# Altium schematic sheet 54. SOC CORE HCPS-B.SchDoc: HCPS B - VDD CORE
size 513 x 386 mm; Project: PROC154E2(001)_SK_AM69; Issue: 1.0; RevCode: E3; Page Create Date: March  8, 1995; Variant Name: Core Design; Schematic Page Number: 54; Page Number: 54; Page Size: C; Comment: MISTRAL_TITLEBLK_CSIZE_1; Page Count: 62; Schematic Page Count: 62; Name: PROC154E2 001 SK AM69; DsnPath: C:\Users\danie\Downloads\sprr466c\PROC154E3_RP\PROC154E3_SCH.DSN; SchematicName: SCHEMATIC1; PageName: 54. SOC CORE HCPS-B; PageSize: C; TopSchematic: True
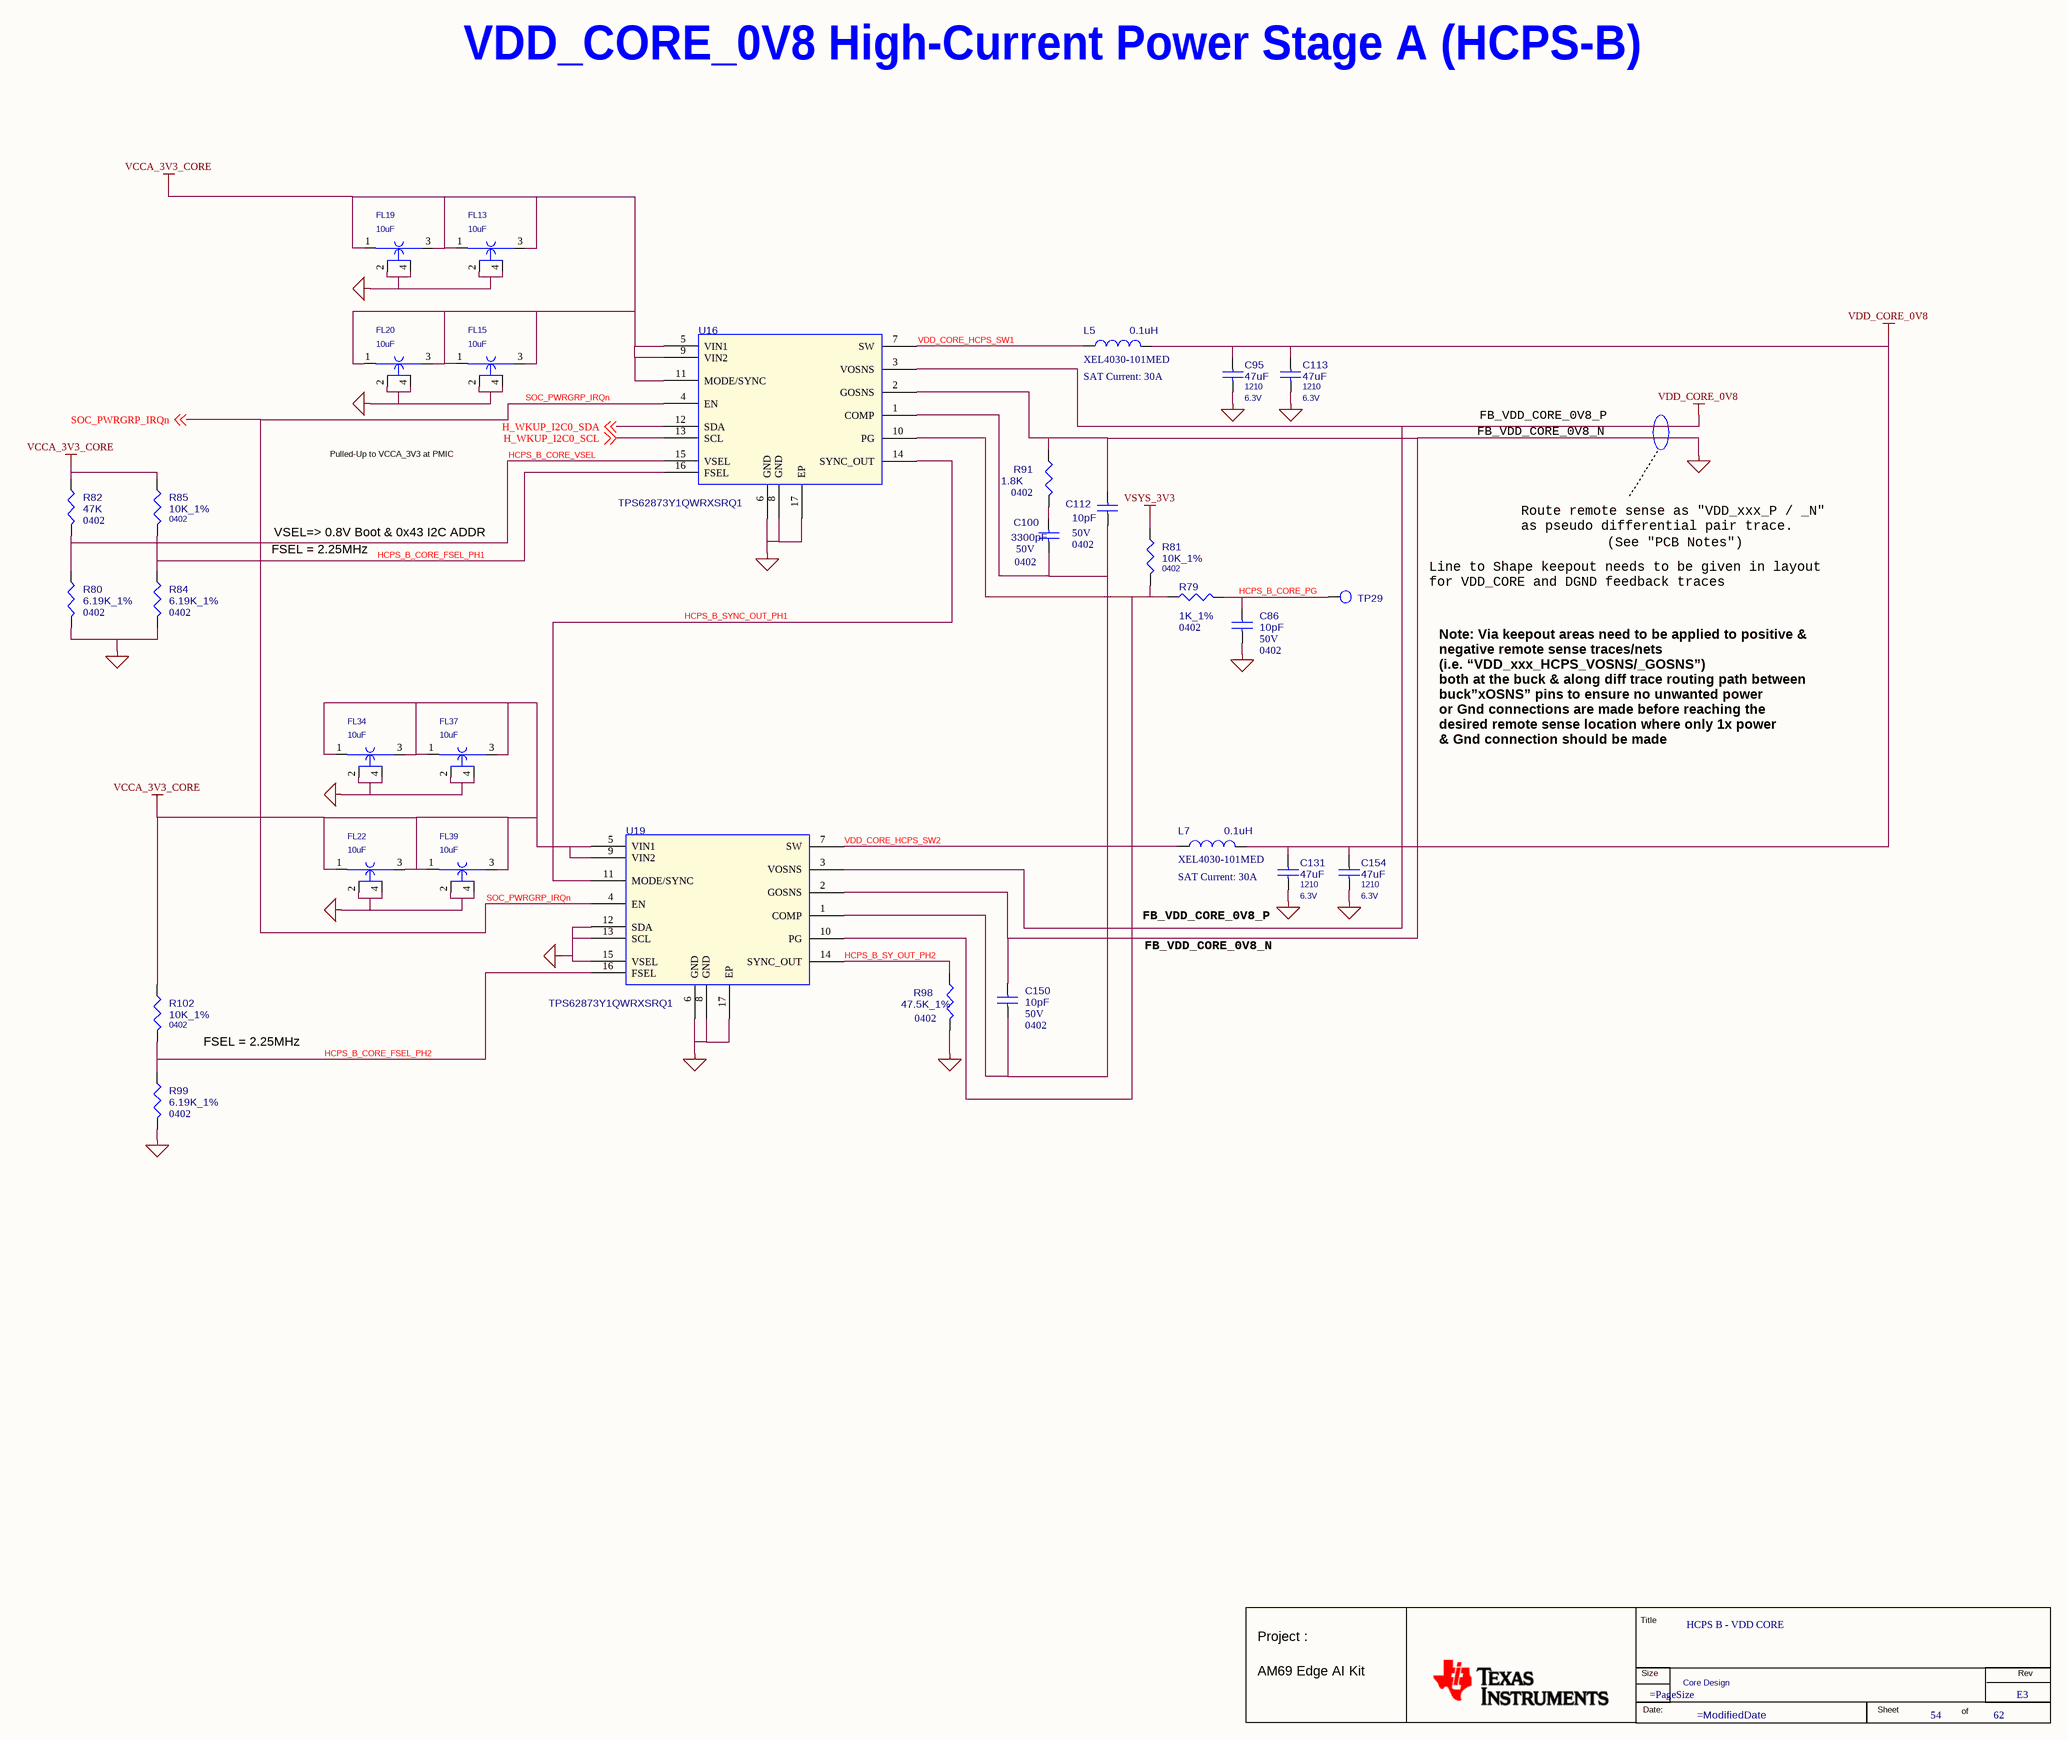
[diagram p0: 54. SOC CORE HCPS-B.SchDoc]

## Parts
*  RevCode: E3  Title: HCPS B - VDD CORE  Page Number: 54  Page Count: 62  Variant Name: Core Design  (hidden comment: MISTRAL_TITLEBLK_CSIZE_1)  (graphical)
C86  10pF  Package: 0402  Voltage: 50V  [CAP0402_0-75]
C95  47uF  Package: 1210  Voltage: 6.3V  [CAP1210_2-75]
C100  3300pF  Package: 0402  Voltage: 50V  [CAP0402_0-75]
C112  10pF  Package: 0402  Voltage: 50V  [CAP0402_0-75]
C113  47uF  Package: 1210  Voltage: 6.3V  [CAP1210_2-75]
C131  47uF  Package: 1210  Voltage: 6.3V  [CAP1210_2-75]
C150  10pF  Package: 0402  Voltage: 50V  [CAP0402_0-75]
C154  47uF  Package: 1210  Voltage: 6.3V  [CAP1210_2-75]
FL13  10uF  [EMIFIL_NFM18C_0603_0-7_TI]
FL15  10uF  [EMIFIL_NFM18C_0603_0-7_TI]
FL19  10uF  [EMIFIL_NFM18C_0603_0-7_TI]
FL20  10uF  [EMIFIL_NFM18C_0603_0-7_TI]
FL22  10uF  [EMIFIL_NFM18C_0603_0-7_TI]
FL34  10uF  [EMIFIL_NFM18C_0603_0-7_TI]
FL37  10uF  [EMIFIL_NFM18C_0603_0-7_TI]
FL39  10uF  [EMIFIL_NFM18C_0603_0-7_TI]
L5  0.1uH  Mfr_part_number: XEL4030-101MED  SAT Current: 30A  [IND_XEL4030_170X170_SMD_3-2]
L7  0.1uH  Mfr_part_number: XEL4030-101MED  SAT Current: 30A  [IND_XEL4030_170X170_SMD_3-2]
R79  1K_1%  Package: 0402  [RES0402_0-5]
R80  6.19K_1%  Package: 0402  [RES0402_0-5]
R81  10K_1%  Package: 0402  [RES0402_0-5]
R82  47K  Package: 0402  [RES0402_0-5]
R84  6.19K_1%  Package: 0402  [RES0402_0-5]
R85  10K_1%  Package: 0402  [RES0402_0-5]
R91  1.8K  Package: 0402  [RES0402_0-5]
R98  47.5K_1%  Package: 0402  [RES0402_0-5]
R99  6.19K_1%  Package: 0402  [RES0402_0-5]
R102  10K_1%  Package: 0402  [RES0402_0-5]
TP29  TP30_SMD  [TP30_SMD]  (value not drawn)
U16  TPS62873Y1QWRXSRQ1  [VQFN16_TPS62872-Q1_100X140_1-1]
U19  TPS62873Y1QWRXSRQ1  [VQFN16_TPS62872-Q1_100X140_1-1]

## Nets
DGND: C86.2 C95.2 C112.1 C113.2 C131.2 C150.1 C154.2 FL13.2 FL13.4 FL15.2 FL15.4 FL19.2 FL19.4 FL20.2 FL20.4 FL22.2 FL22.4 FL34.2 FL34.4 FL37.2 FL37.4 FL39.2 FL39.4 R80.2 R84.2 R91.1 R98.2 R99.2 U16.2(GOSNS) U16.6(GND) U16.8(GND) U16.17(EP) U19.2(GOSNS) U19.6(GND) U19.8(GND) U19.12(SDA) U19.13(SCL) U19.15(VSEL) U19.17(EP)
VCCA_3V3_CORE: FL13.1 FL13.3 FL15.1 FL15.3 FL19.1 FL19.3 FL20.1 FL20.3 FL22.1 FL22.3 FL34.1 FL34.3 FL37.1 FL37.3 FL39.1 FL39.3 R82.1 R85.1 R102.1 U16.5(VIN1) U16.9(VIN2) U16.11(MODE/SYNC) U19.5(VIN1) U19.9(VIN2)
VDD_CORE_0V8: C95.1 C113.1 C131.1 C154.1 L5.2 L7.2 U16.3(VOSNS) U19.3(VOSNS)
VSYS_3V3: R81.1
H_WKUP_I2C0_SCL: U16.13(SCL) ; off-sheet H_WKUP_I2C0_SCL
H_WKUP_I2C0_SDA: U16.12(SDA) ; off-sheet H_WKUP_I2C0_SDA
HCPS_B_CORE_FSEL_PH1: R84.1 R85.2 U16.16(FSEL)
HCPS_B_CORE_FSEL_PH2: R99.1 R102.2 U19.16(FSEL)
HCPS_B_CORE_PG: C86.1 R79.2 TP29.1(TP)
HCPS_B_CORE_VSEL: R80.1 R82.2 U16.15(VSEL)
HCPS_B_SY_OUT_PH2: R98.1 U19.14(SYNC_OUT)
HCPS_B_SYNC_OUT_PH1: U16.14(SYNC_OUT) U19.11(MODE/SYNC)
SOC_PWRGRP_IRQn: U16.4(EN) U19.4(EN) ; off-sheet SOC_PWRGRP_IRQn
VDD_CORE_HCPS_SW1: L5.1 U16.7(SW)
VDD_CORE_HCPS_SW2: L7.1 U19.7(SW)
NetC100_1: C100.1 R91.2
NetC100_2: C100.2 C112.2 C150.2 U16.1(COMP) U19.1(COMP)
NetR79_1: R79.1 R81.2 U16.10(PG) U19.10(PG)

## Notes on the sheet
- VDD_CORE_0V8 High-Current Power Stage A (HCPS-B)
- FB_VDD_CORE_0V8_N
- FB_VDD_CORE_0V8_P
- Pulled-Up to VCCA_3V3 at PMIC
- VSEL=> 0.8V Boot & 0x43 I2C ADDR
- Route remote sense as "VDD_xxx_P / _N"
  as pseudo differential pair trace.
- (See "PCB Notes")
- FSEL = 2.25MHz
- Line to Shape keepout needs to be given in layout
  for VDD_CORE and DGND feedback traces
- Note: Via keepout areas need to be applied to positive &
  negative remote sense traces/nets
  (i.e. “VDD_xxx_HCPS_VOSNS/_GOSNS”)
  both at the buck & along diff trace routing path between
  buck”xOSNS” pins to ensure no unwanted power
  or Gnd connections are made before reaching the
  desired remote sense location where only 1x power
  & Gnd connection should be made
- (in symbol MISTRAL_TITLEBLK_CSIZE_1) Title; Project :; Size; Rev; AM69 Edge AI Kit; Date:; Sheet; of

## Library data of the parts
* = MISTRAL_TITLEBLK_CSIZE_1: Issue: 1.0; Project: PROC154E2(001)_SK_AM69; Name: PROC154E2 001 SK AM69; Page Create Date: March  8, 1995; Page Size: =PageSize; Page Modify Date: =ModifiedDate; Schematic Page Count: 62; Schematic Page Number: 54
C86 = CAP_Dup1: CAP CERAMIC 10pF 50V 1% C0G(NP0) 0402; Part Reference: C86; Automotive Alternate_mfr_part_number: CGA2B1X7R1C104K050BC; Automotive Alternate_mfr_name: TDK; Direct Alternate_mfr_part_number: GCM155R71C104JA55D; Direct Alternate_mfr_name: MURATA; Part_type: CAPACITORS\CERAMIC; Mfr_part_number: 04025U100FAT2A; Mfr_name: AVX CORPORATION; Mistral Part No: 120014060010-R; Custom_Duty: 15%; Customs_HS_Code: 85322990; Wattage: NA; Project: AEGIS_POM; Value: 10pF; Footprint Path: Y:\MIS_DATABASE\Library\ALTIUM_TOOL\PCB_FOOTPRINTS\Altium_Footprint_Lib.PcbLib; Library Path: Y:\MIS_DATABASE\Library\ALTIUM_TOOL\SCHEMATICS_PARTS\MS_DISCRETE_Library.schlib; MECHANICAL 3D STEP FILE: CAP0402_0-75; Chkd/date: VASANTHA/200614; Crtd /date: NAVEED/170614; Datasheet: Y:\MIS_DATABASE\DATASHEETS\CAPACITORS\AVX_MLC.PDF; Temperature: -55°C+125°C; Weight: 0.65mg; Height: 0.55MM; Library Ref: CAP; Distributor_part_number: 478-5717-1-ND; Distributor_name: DIGIKEY; Tolerance: 1%; Footprint Ref: CAP0402_0-75; Manufacturer: AVX CORPORATION; PCB Footprint: CAP0402_0-75
C95 = CAP_Dup1: CAP CERAMIC 47uF 6.3V 10% X7R AUTO 1210; Part Reference: C95; Automotive Alternate_mfr_part_number: CGA6P1X7S1A476M; Automotive Alternate_mfr_name: TDK; Part_type: CAPACITORS\CERAMIC; Mfr_part_number: GCM32ER70J476KE19L; Mfr_name: MURATA; Mistral Part No: 120018090056-R; Custom_Duty: 15%; Customs_HS_Code: 85322990; Wattage: NA; Project: TI_J7_SVB-DUT; Value: 47uF; Direct Alternate_mfr_part_number: CGA6P1X7S1A476M; Direct Alternate_mfr_name: TDK; Footprint Path: Y:\MIS_DATABASE\Library\ALTIUM_TOOL\PCB_FOOTPRINTS\Altium_Footprint_Lib.PcbLib; Library Path: Y:\MIS_DATABASE\Library\ALTIUM_TOOL\SCHEMATICS_PARTS\MS_DISCRETE_Library.schlib; MECHANICAL 3D STEP FILE: CAP1210_2-75; Chkd/date: MANIRAJA/280918; Crtd /date: ALVY/280918; Datasheet: Y:\MIS_DATABASE\DATASHEETS\CAPACITORS\MURATA-GCM-SER.PDF; Temperature: -55°C+125°C; Weight: 110mg; Height: 2.70MM; Library Ref: CAP; Distributor_part_number: 490-4844-1-ND; Distributor_name: DIGIKEY; Tolerance: 10%; Footprint Ref: CAP1210_2-75; Manufacturer: MURATA; PCB Footprint: CAP1210_2-75
C100 = CAP_Dup1: CAP CERAMIC 3300pF 50V 10% X7R 0402; Part Reference: C100; Automotive Alternate_mfr_part_number: CGA2B1X7R1C104K050BC; Automotive Alternate_mfr_name: TDK; Direct Alternate_mfr_part_number: GCM155R71C104JA55D; Direct Alternate_mfr_name: MURATA; Part_type: CAPACITORS\CERAMIC; Mfr_part_number: GCM155R71H332KA37D; Mistral Part No: 120022080077-R; Custom_Duty: 15%; Customs_HS_Code: 85322990; Wattage: NA; Project: BRUKER_SD820_COMMONDO; Value: 3300pF; Footprint Path: Y:\MIS_DATABASE\Library\ALTIUM_TOOL\PCB_FOOTPRINTS\Altium_Footprint_Lib.PcbLib; Library Path: Y:\MIS_DATABASE\Library\ALTIUM_TOOL\SCHEMATICS_PARTS\MS_DISCRETE_Library.schlib; MECHANICAL 3D STEP FILE: CAP0402_0-75; Chkd/date: PRAVEEN/300822; Crtd /date: PRAVEEN/300822; Datasheet: Y:\MIS_DATABASE\DATASHEETS\CAPACITORS\GCM155R71H332KA37D.PDF; Temperature: -55°C+125°C; Weight: 1.6mg; Height: 0.55MM; Library Ref: CAP; Distributor_part_number: 490-8001-1-ND; Distributor_name: DIGIKEY; Tolerance: 10%; Mfr_name: MURATA; Footprint Ref: CAP0402_0-75; Manufacturer: MURATA; PCB Footprint: CAP0402_0-75
C112 = CAP_Dup1: CAP CERAMIC 10pF 50V 1% C0G(NP0) 0402; Part Reference: C112; Automotive Alternate_mfr_part_number: CGA2B1X7R1C104K050BC; Automotive Alternate_mfr_name: TDK; Direct Alternate_mfr_part_number: GCM155R71C104JA55D; Direct Alternate_mfr_name: MURATA; Part_type: CAPACITORS\CERAMIC; Mfr_part_number: 04025U100FAT2A; Mfr_name: AVX CORPORATION; Mistral Part No: 120014060010-R; Custom_Duty: 15%; Customs_HS_Code: 85322990; Wattage: NA; Project: AEGIS_POM; Value: 10pF; Footprint Path: Y:\MIS_DATABASE\Library\ALTIUM_TOOL\PCB_FOOTPRINTS\Altium_Footprint_Lib.PcbLib; Library Path: Y:\MIS_DATABASE\Library\ALTIUM_TOOL\SCHEMATICS_PARTS\MS_DISCRETE_Library.schlib; MECHANICAL 3D STEP FILE: CAP0402_0-75; Chkd/date: VASANTHA/200614; Crtd /date: NAVEED/170614; Datasheet: Y:\MIS_DATABASE\DATASHEETS\CAPACITORS\AVX_MLC.PDF; Temperature: -55°C+125°C; Weight: 0.65mg; Height: 0.55MM; Library Ref: CAP; Distributor_part_number: 478-5717-1-ND; Distributor_name: DIGIKEY; Tolerance: 1%; Footprint Ref: CAP0402_0-75; Manufacturer: AVX CORPORATION; PCB Footprint: CAP0402_0-75
C113 = CAP_Dup1: CAP CERAMIC 47uF 6.3V 10% X7R AUTO 1210; Part Reference: C113; Automotive Alternate_mfr_part_number: CGA6P1X7S1A476M; Automotive Alternate_mfr_name: TDK; Part_type: CAPACITORS\CERAMIC; Mfr_part_number: GCM32ER70J476KE19L; Mfr_name: MURATA; Mistral Part No: 120018090056-R; Custom_Duty: 15%; Customs_HS_Code: 85322990; Wattage: NA; Project: TI_J7_SVB-DUT; Value: 47uF; Direct Alternate_mfr_part_number: CGA6P1X7S1A476M; Direct Alternate_mfr_name: TDK; Footprint Path: Y:\MIS_DATABASE\Library\ALTIUM_TOOL\PCB_FOOTPRINTS\Altium_Footprint_Lib.PcbLib; Library Path: Y:\MIS_DATABASE\Library\ALTIUM_TOOL\SCHEMATICS_PARTS\MS_DISCRETE_Library.schlib; MECHANICAL 3D STEP FILE: CAP1210_2-75; Chkd/date: MANIRAJA/280918; Crtd /date: ALVY/280918; Datasheet: Y:\MIS_DATABASE\DATASHEETS\CAPACITORS\MURATA-GCM-SER.PDF; Temperature: -55°C+125°C; Weight: 110mg; Height: 2.70MM; Library Ref: CAP; Distributor_part_number: 490-4844-1-ND; Distributor_name: DIGIKEY; Tolerance: 10%; Footprint Ref: CAP1210_2-75; Manufacturer: MURATA; PCB Footprint: CAP1210_2-75
C131 = CAP_Dup1: CAP CERAMIC 47uF 6.3V 10% X7R AUTO 1210; Part Reference: C131; Automotive Alternate_mfr_part_number: CGA6P1X7S1A476M; Automotive Alternate_mfr_name: TDK; Part_type: CAPACITORS\CERAMIC; Mfr_part_number: GCM32ER70J476KE19L; Mfr_name: MURATA; Mistral Part No: 120018090056-R; Custom_Duty: 15%; Customs_HS_Code: 85322990; Wattage: NA; Project: TI_J7_SVB-DUT; Value: 47uF; Direct Alternate_mfr_part_number: CGA6P1X7S1A476M; Direct Alternate_mfr_name: TDK; Footprint Path: Y:\MIS_DATABASE\Library\ALTIUM_TOOL\PCB_FOOTPRINTS\Altium_Footprint_Lib.PcbLib; Library Path: Y:\MIS_DATABASE\Library\ALTIUM_TOOL\SCHEMATICS_PARTS\MS_DISCRETE_Library.schlib; MECHANICAL 3D STEP FILE: CAP1210_2-75; Chkd/date: MANIRAJA/280918; Crtd /date: ALVY/280918; Datasheet: Y:\MIS_DATABASE\DATASHEETS\CAPACITORS\MURATA-GCM-SER.PDF; Temperature: -55°C+125°C; Weight: 110mg; Height: 2.70MM; Library Ref: CAP; Distributor_part_number: 490-4844-1-ND; Distributor_name: DIGIKEY; Tolerance: 10%; Footprint Ref: CAP1210_2-75; Manufacturer: MURATA; PCB Footprint: CAP1210_2-75
C150 = CAP_Dup1: CAP CERAMIC 10pF 50V 1% C0G(NP0) 0402; Part Reference: C150; Automotive Alternate_mfr_part_number: CGA2B1X7R1C104K050BC; Automotive Alternate_mfr_name: TDK; Direct Alternate_mfr_part_number: GCM155R71C104JA55D; Direct Alternate_mfr_name: MURATA; Part_type: CAPACITORS\CERAMIC; Mfr_part_number: 04025U100FAT2A; Mfr_name: AVX CORPORATION; Mistral Part No: 120014060010-R; Custom_Duty: 15%; Customs_HS_Code: 85322990; Wattage: NA; Project: AEGIS_POM; Value: 10pF; Footprint Path: Y:\MIS_DATABASE\Library\ALTIUM_TOOL\PCB_FOOTPRINTS\Altium_Footprint_Lib.PcbLib; Library Path: Y:\MIS_DATABASE\Library\ALTIUM_TOOL\SCHEMATICS_PARTS\MS_DISCRETE_Library.schlib; MECHANICAL 3D STEP FILE: CAP0402_0-75; Chkd/date: VASANTHA/200614; Crtd /date: NAVEED/170614; Datasheet: Y:\MIS_DATABASE\DATASHEETS\CAPACITORS\AVX_MLC.PDF; Temperature: -55°C+125°C; Weight: 0.65mg; Height: 0.55MM; Library Ref: CAP; Distributor_part_number: 478-5717-1-ND; Distributor_name: DIGIKEY; Tolerance: 1%; Footprint Ref: CAP0402_0-75; Manufacturer: AVX CORPORATION; PCB Footprint: CAP0402_0-75
C154 = CAP_Dup1: CAP CERAMIC 47uF 6.3V 10% X7R AUTO 1210; Part Reference: C154; Automotive Alternate_mfr_part_number: CGA6P1X7S1A476M; Automotive Alternate_mfr_name: TDK; Part_type: CAPACITORS\CERAMIC; Mfr_part_number: GCM32ER70J476KE19L; Mfr_name: MURATA; Mistral Part No: 120018090056-R; Custom_Duty: 15%; Customs_HS_Code: 85322990; Wattage: NA; Project: TI_J7_SVB-DUT; Value: 47uF; Direct Alternate_mfr_part_number: CGA6P1X7S1A476M; Direct Alternate_mfr_name: TDK; Footprint Path: Y:\MIS_DATABASE\Library\ALTIUM_TOOL\PCB_FOOTPRINTS\Altium_Footprint_Lib.PcbLib; Library Path: Y:\MIS_DATABASE\Library\ALTIUM_TOOL\SCHEMATICS_PARTS\MS_DISCRETE_Library.schlib; MECHANICAL 3D STEP FILE: CAP1210_2-75; Chkd/date: MANIRAJA/280918; Crtd /date: ALVY/280918; Datasheet: Y:\MIS_DATABASE\DATASHEETS\CAPACITORS\MURATA-GCM-SER.PDF; Temperature: -55°C+125°C; Weight: 110mg; Height: 2.70MM; Library Ref: CAP; Distributor_part_number: 490-4844-1-ND; Distributor_name: DIGIKEY; Tolerance: 10%; Footprint Ref: CAP1210_2-75; Manufacturer: MURATA; PCB Footprint: CAP1210_2-75
FL13 = CAP_NFM_TI: PASSIVE FILTER EMI 10uF 4V AUTO 0603; Part Reference: FL13; Mfr_part_number: NFM18HC106D0G_TI; Mfr_name: MURATA; Mistral Part No: 130018100049; Custom_Duty: 15%; Customs_HS_Code: 85412900; Wattage: NA; Project: TI_J7ES_EVM_SOM; Value: 10uF; Footprint Path: Y:\MIS_DATABASE\Library\ALTIUM_TOOL\PCB_FOOTPRINTS\Altium_Footprint_Lib.PcbLib; Library Path: Y:\MIS_DATABASE\Library\ALTIUM_TOOL\SCHEMATICS_PARTS\MS_FILTER_Library.schlib; MECHANICAL 3D STEP FILE: EMIFIL_NFM18C_0603_0-7_TI; RoHS: NA; Chkd/date: MANIRAJA/251018; Crtd /date: ALVY/251018; Datasheet: Y:\MIS_DATABASE\DATASHEETS\DISCRETES\INDUCTORS\NFM18HC-SER.PDF; Temperature: NA; Weight: NA; Height: 0.70MM; PCB Footprint: EMIFIL_NFM18C_0603_0-7_TI; Library Ref: CAP_NFM_TI; Distributor_part_number: NA; Distributor_name: NA; Package: 0603; Voltage: 4V; Tolerance: NA; Part_type: FILTER; Footprint Ref: EMIFIL_NFM18C_0603_0-7_TI
FL15 = CAP_NFM_TI: PASSIVE FILTER EMI 10uF 4V AUTO 0603; Part Reference: FL15; Mfr_part_number: NFM18HC106D0G_TI; Mfr_name: MURATA; Mistral Part No: 130018100049; Custom_Duty: 15%; Customs_HS_Code: 85412900; Wattage: NA; Project: TI_J7ES_EVM_SOM; Value: 10uF; Footprint Path: Y:\MIS_DATABASE\Library\ALTIUM_TOOL\PCB_FOOTPRINTS\Altium_Footprint_Lib.PcbLib; Library Path: Y:\MIS_DATABASE\Library\ALTIUM_TOOL\SCHEMATICS_PARTS\MS_FILTER_Library.schlib; MECHANICAL 3D STEP FILE: EMIFIL_NFM18C_0603_0-7_TI; RoHS: NA; Chkd/date: MANIRAJA/251018; Crtd /date: ALVY/251018; Datasheet: Y:\MIS_DATABASE\DATASHEETS\DISCRETES\INDUCTORS\NFM18HC-SER.PDF; Temperature: NA; Weight: NA; Height: 0.70MM; PCB Footprint: EMIFIL_NFM18C_0603_0-7_TI; Library Ref: CAP_NFM_TI; Distributor_part_number: NA; Distributor_name: NA; Package: 0603; Voltage: 4V; Tolerance: NA; Part_type: FILTER; Footprint Ref: EMIFIL_NFM18C_0603_0-7_TI
FL19 = CAP_NFM_TI: PASSIVE FILTER EMI 10uF 4V AUTO 0603; Part Reference: FL19; Mfr_part_number: NFM18HC106D0G_TI; Mfr_name: MURATA; Mistral Part No: 130018100049; Custom_Duty: 15%; Customs_HS_Code: 85412900; Wattage: NA; Project: TI_J7ES_EVM_SOM; Value: 10uF; Footprint Path: Y:\MIS_DATABASE\Library\ALTIUM_TOOL\PCB_FOOTPRINTS\Altium_Footprint_Lib.PcbLib; Library Path: Y:\MIS_DATABASE\Library\ALTIUM_TOOL\SCHEMATICS_PARTS\MS_FILTER_Library.schlib; MECHANICAL 3D STEP FILE: EMIFIL_NFM18C_0603_0-7_TI; RoHS: NA; Chkd/date: MANIRAJA/251018; Crtd /date: ALVY/251018; Datasheet: Y:\MIS_DATABASE\DATASHEETS\DISCRETES\INDUCTORS\NFM18HC-SER.PDF; Temperature: NA; Weight: NA; Height: 0.70MM; PCB Footprint: EMIFIL_NFM18C_0603_0-7_TI; Library Ref: CAP_NFM_TI; Distributor_part_number: NA; Distributor_name: NA; Package: 0603; Voltage: 4V; Tolerance: NA; Part_type: FILTER; Footprint Ref: EMIFIL_NFM18C_0603_0-7_TI
FL20 = CAP_NFM_TI: PASSIVE FILTER EMI 10uF 4V AUTO 0603; Part Reference: FL20; Mfr_part_number: NFM18HC106D0G_TI; Mfr_name: MURATA; Mistral Part No: 130018100049; Custom_Duty: 15%; Customs_HS_Code: 85412900; Wattage: NA; Project: TI_J7ES_EVM_SOM; Value: 10uF; Footprint Path: Y:\MIS_DATABASE\Library\ALTIUM_TOOL\PCB_FOOTPRINTS\Altium_Footprint_Lib.PcbLib; Library Path: Y:\MIS_DATABASE\Library\ALTIUM_TOOL\SCHEMATICS_PARTS\MS_FILTER_Library.schlib; MECHANICAL 3D STEP FILE: EMIFIL_NFM18C_0603_0-7_TI; RoHS: NA; Chkd/date: MANIRAJA/251018; Crtd /date: ALVY/251018; Datasheet: Y:\MIS_DATABASE\DATASHEETS\DISCRETES\INDUCTORS\NFM18HC-SER.PDF; Temperature: NA; Weight: NA; Height: 0.70MM; PCB Footprint: EMIFIL_NFM18C_0603_0-7_TI; Library Ref: CAP_NFM_TI; Distributor_part_number: NA; Distributor_name: NA; Package: 0603; Voltage: 4V; Tolerance: NA; Part_type: FILTER; Footprint Ref: EMIFIL_NFM18C_0603_0-7_TI
FL22 = CAP_NFM_TI: PASSIVE FILTER EMI 10uF 4V AUTO 0603; Part Reference: FL22; Mfr_part_number: NFM18HC106D0G_TI; Mfr_name: MURATA; Mistral Part No: 130018100049; Custom_Duty: 15%; Customs_HS_Code: 85412900; Wattage: NA; Project: TI_J7ES_EVM_SOM; Value: 10uF; Footprint Path: Y:\MIS_DATABASE\Library\ALTIUM_TOOL\PCB_FOOTPRINTS\Altium_Footprint_Lib.PcbLib; Library Path: Y:\MIS_DATABASE\Library\ALTIUM_TOOL\SCHEMATICS_PARTS\MS_FILTER_Library.schlib; MECHANICAL 3D STEP FILE: EMIFIL_NFM18C_0603_0-7_TI; RoHS: NA; Chkd/date: MANIRAJA/251018; Crtd /date: ALVY/251018; Datasheet: Y:\MIS_DATABASE\DATASHEETS\DISCRETES\INDUCTORS\NFM18HC-SER.PDF; Temperature: NA; Weight: NA; Height: 0.70MM; PCB Footprint: EMIFIL_NFM18C_0603_0-7_TI; Library Ref: CAP_NFM_TI; Distributor_part_number: NA; Distributor_name: NA; Package: 0603; Voltage: 4V; Tolerance: NA; Part_type: FILTER; Footprint Ref: EMIFIL_NFM18C_0603_0-7_TI
FL34 = CAP_NFM_TI: PASSIVE FILTER EMI 10uF 4V AUTO 0603; Part Reference: FL34; Mfr_part_number: NFM18HC106D0G_TI; Mfr_name: MURATA; Mistral Part No: 130018100049; Custom_Duty: 15%; Customs_HS_Code: 85412900; Wattage: NA; Project: TI_J7ES_EVM_SOM; Value: 10uF; Footprint Path: Y:\MIS_DATABASE\Library\ALTIUM_TOOL\PCB_FOOTPRINTS\Altium_Footprint_Lib.PcbLib; Library Path: Y:\MIS_DATABASE\Library\ALTIUM_TOOL\SCHEMATICS_PARTS\MS_FILTER_Library.schlib; MECHANICAL 3D STEP FILE: EMIFIL_NFM18C_0603_0-7_TI; RoHS: NA; Chkd/date: MANIRAJA/251018; Crtd /date: ALVY/251018; Datasheet: Y:\MIS_DATABASE\DATASHEETS\DISCRETES\INDUCTORS\NFM18HC-SER.PDF; Temperature: NA; Weight: NA; Height: 0.70MM; PCB Footprint: EMIFIL_NFM18C_0603_0-7_TI; Library Ref: CAP_NFM_TI; Distributor_part_number: NA; Distributor_name: NA; Package: 0603; Voltage: 4V; Tolerance: NA; Part_type: FILTER; Footprint Ref: EMIFIL_NFM18C_0603_0-7_TI
FL37 = CAP_NFM_TI: PASSIVE FILTER EMI 10uF 4V AUTO 0603; Part Reference: FL37; Mfr_part_number: NFM18HC106D0G_TI; Mfr_name: MURATA; Mistral Part No: 130018100049; Custom_Duty: 15%; Customs_HS_Code: 85412900; Wattage: NA; Project: TI_J7ES_EVM_SOM; Value: 10uF; Footprint Path: Y:\MIS_DATABASE\Library\ALTIUM_TOOL\PCB_FOOTPRINTS\Altium_Footprint_Lib.PcbLib; Library Path: Y:\MIS_DATABASE\Library\ALTIUM_TOOL\SCHEMATICS_PARTS\MS_FILTER_Library.schlib; MECHANICAL 3D STEP FILE: EMIFIL_NFM18C_0603_0-7_TI; RoHS: NA; Chkd/date: MANIRAJA/251018; Crtd /date: ALVY/251018; Datasheet: Y:\MIS_DATABASE\DATASHEETS\DISCRETES\INDUCTORS\NFM18HC-SER.PDF; Temperature: NA; Weight: NA; Height: 0.70MM; PCB Footprint: EMIFIL_NFM18C_0603_0-7_TI; Library Ref: CAP_NFM_TI; Distributor_part_number: NA; Distributor_name: NA; Package: 0603; Voltage: 4V; Tolerance: NA; Part_type: FILTER; Footprint Ref: EMIFIL_NFM18C_0603_0-7_TI
FL39 = CAP_NFM_TI: PASSIVE FILTER EMI 10uF 4V AUTO 0603; Part Reference: FL39; Mfr_part_number: NFM18HC106D0G_TI; Mfr_name: MURATA; Mistral Part No: 130018100049; Custom_Duty: 15%; Customs_HS_Code: 85412900; Wattage: NA; Project: TI_J7ES_EVM_SOM; Value: 10uF; Footprint Path: Y:\MIS_DATABASE\Library\ALTIUM_TOOL\PCB_FOOTPRINTS\Altium_Footprint_Lib.PcbLib; Library Path: Y:\MIS_DATABASE\Library\ALTIUM_TOOL\SCHEMATICS_PARTS\MS_FILTER_Library.schlib; MECHANICAL 3D STEP FILE: EMIFIL_NFM18C_0603_0-7_TI; RoHS: NA; Chkd/date: MANIRAJA/251018; Crtd /date: ALVY/251018; Datasheet: Y:\MIS_DATABASE\DATASHEETS\DISCRETES\INDUCTORS\NFM18HC-SER.PDF; Temperature: NA; Weight: NA; Height: 0.70MM; PCB Footprint: EMIFIL_NFM18C_0603_0-7_TI; Library Ref: CAP_NFM_TI; Distributor_part_number: NA; Distributor_name: NA; Package: 0603; Voltage: 4V; Tolerance: NA; Part_type: FILTER; Footprint Ref: EMIFIL_NFM18C_0603_0-7_TI
L5 = INDUCTOR: IND POWER 0.1uH 25.8A 20% SMD; Part Reference: L5; Part #: 105324-1470R; Mfr_name: COILCRAFT; Mistral Part No: 130022010018-R; Custom_Duty: 24%; Customs_HS_Code: 85437099; Wattage: NA; Project: J7AHP_PROTO_BRD; Value: 0.1uH; Footprint Path: Y:\MIS_DATABASE\Library\ALTIUM_TOOL\PCB_FOOTPRINTS\Altium_Footprint_Lib.PcbLib; Library Path: Y:\MIS_DATABASE\Library\ALTIUM_TOOL\SCHEMATICS_PARTS\MS_DISCRETE_Library.schlib; MECHANICAL 3D STEP FILE: IND_XEL4030_170X170_SMD_3-2; Chkd/date: MANIRAJA/170122; Crtd /date: TAMILARASU/170122; Datasheet: Y:\MIS_DATABASE\DATASHEETS\DISCRETES\INDUCTORS\XEL4030_JUN20.PDF; Temperature: -40°C+125°C; Weight: 280mg; Height: 3.20MM; Library Ref: INDUCTOR; Distributor_part_number: 994-XEL4030-101MED; Distributor_name: MOUSER; Package: SMD; Voltage: NA; Tolerance: 20%; Part_type: INDUCTOR; Footprint Ref: IND_XEL4030_170X170_SMD_3-2; Manufacturer: COILCRAFT; PCB Footprint: IND_XEL4030_170X170_SMD_3-2
L7 = INDUCTOR: IND POWER 0.1uH 25.8A 20% SMD; Part Reference: L7; Part #: 105324-1470R; Mfr_name: COILCRAFT; Mistral Part No: 130022010018-R; Custom_Duty: 24%; Customs_HS_Code: 85437099; Wattage: NA; Project: J7AHP_PROTO_BRD; Value: 0.1uH; Footprint Path: Y:\MIS_DATABASE\Library\ALTIUM_TOOL\PCB_FOOTPRINTS\Altium_Footprint_Lib.PcbLib; Library Path: Y:\MIS_DATABASE\Library\ALTIUM_TOOL\SCHEMATICS_PARTS\MS_DISCRETE_Library.schlib; MECHANICAL 3D STEP FILE: IND_XEL4030_170X170_SMD_3-2; Chkd/date: MANIRAJA/170122; Crtd /date: TAMILARASU/170122; Datasheet: Y:\MIS_DATABASE\DATASHEETS\DISCRETES\INDUCTORS\XEL4030_JUN20.PDF; Temperature: -40°C+125°C; Weight: 280mg; Height: 3.20MM; Library Ref: INDUCTOR; Distributor_part_number: 994-XEL4030-101MED; Distributor_name: MOUSER; Package: SMD; Voltage: NA; Tolerance: 20%; Part_type: INDUCTOR; Footprint Ref: IND_XEL4030_170X170_SMD_3-2; Manufacturer: COILCRAFT; PCB Footprint: IND_XEL4030_170X170_SMD_3-2
R79 = RESISTOR_Dup2: RES 1K 1/10W 1% 0402; Part Reference: R79; Mistral Part No: 110009030411-R; Mfr_name: PANASONIC-ECG; Mfr_part_number: ERJ-2RKF1001X; Part_type: RESISTORS\FIXED; Project: VOCERA; Voltage: NA; Customs_HS_Code: 85332119; Custom_Duty: 15%; Value: 1K_1%; Footprint Ref: RES0402_0-5; Tolerance: 1%; Wattage: 1/10W; Distributor_name: DIGIKEY; Distributor_part_number: P1.00KLCT-ND; Library Ref: RESISTOR; Height: 0.40MM; Weight: 0.8mg; Temperature: -55°C+155°C; Datasheet: Y:\MIS_DATABASE\DATASHEETS\RESISTORS\PAN-ERJSER_NOV17.PDF; Crtd /date: MAZHAR/150506; Chkd/date: VASANTHA/281216; MECHANICAL 3D STEP FILE: RES0402_0-5; Library Path: Y:\MIS_DATABASE\Library\ALTIUM_TOOL\SCHEMATICS_PARTS\MS_DISCRETE_Library.schlib; Footprint Path: Y:\MIS_DATABASE\Library\ALTIUM_TOOL\PCB_FOOTPRINTS\Altium_Footprint_Lib.PcbLib; Manufacturer: PANASONIC-ECG; PCB Footprint: RES0402_0-5
R80 = RESISTOR_Dup2: RES 6.19K 1/16W 1% 0402; Part Reference: R80; Part_type: RESISTORS\FIXED; Mfr_part_number: RC0402FR-076K19L; Mfr_name: YAGEO AMERICA; Mistral Part No: 110022010013-R; Custom_Duty: 15%; Customs_HS_Code: 85332119; Voltage: NA; Project: J7AHP_PROTO_BRD; Value: 6.19K_1%; Footprint Path: Y:\MIS_DATABASE\Library\ALTIUM_TOOL\PCB_FOOTPRINTS\Altium_Footprint_Lib.PcbLib; Library Path: Y:\MIS_DATABASE\Library\ALTIUM_TOOL\SCHEMATICS_PARTS\MS_DISCRETE_Library.schlib; MECHANICAL 3D STEP FILE: RES0402_0-5; Chkd/date: MANIRAJA/190122; Crtd /date: TAMILARASU/190122; Datasheet: Y:\MIS_DATABASE\DATASHEETS\RESISTORS\RCXXXXL-SER_MAR18.PDF; Temperature: -55°C+155°C; Weight: 0.65mg; Height: 0.40MM; Library Ref: RESISTOR; Distributor_part_number: 311-6.19KLRCT-ND; Distributor_name: DIGIKEY; Wattage: 1/16W; Tolerance: 1%; Footprint Ref: RES0402_0-5; Manufacturer: YAGEO AMERICA; PCB Footprint: RES0402_0-5
R81 = RESISTOR_Dup2: RES 10K 1/16W 1% 0402; Part Reference: R81; Part_type: RESISTORS\FIXED; Mfr_part_number: RC0402FR-0710KL; Mfr_name: YAGEO AMERICA; Mistral Part No: 110015090015-R; Custom_Duty: 15%; Customs_HS_Code: 85332119; Voltage: NA; Project: VOCERA; Value: 10K_1%; Footprint Path: Y:\MIS_DATABASE\Library\ALTIUM_TOOL\PCB_FOOTPRINTS\Altium_Footprint_Lib.PcbLib; Library Path: Y:\MIS_DATABASE\Library\ALTIUM_TOOL\SCHEMATICS_PARTS\MS_DISCRETE_Library.schlib; MECHANICAL 3D STEP FILE: RES0402_0-5; Chkd/date: VASANTHA/201216; Crtd /date: GEETHA/290506; Datasheet: Y:\MIS_DATABASE\DATASHEETS\RESISTORS\RCXXXXL-SER_MAR18.PDF; Temperature: -55°C+155°C; Weight: 0.65mg; Height: 0.40MM; Library Ref: RESISTOR; Distributor_part_number: 311-10.0KLRTR-ND; Distributor_name: DIGIKEY; Wattage: 1/16W; Tolerance: 1%; Footprint Ref: RES0402_0-5; Manufacturer: YAGEO AMERICA; PCB Footprint: RES0402_0-5
R82 = RESISTOR_Dup2: RES 47K 1/10W 5% 0402; Part Reference: R82; Part_type: RESISTORS\FIXED; Mfr_part_number: ERJ-2GEJ473X; Mfr_name: PANASONIC-ECG; Mistral Part No: 110009030882-R; Custom_Duty: 15%; Customs_HS_Code: 85332119; Voltage: NA; Project: CTP02_REVA_BASE; Value: 47K; Footprint Path: Y:\MIS_DATABASE\Library\ALTIUM_TOOL\PCB_FOOTPRINTS\Altium_Footprint_Lib.PcbLib; Library Path: Y:\MIS_DATABASE\Library\ALTIUM_TOOL\SCHEMATICS_PARTS\MS_DISCRETE_Library.schlib; MECHANICAL 3D STEP FILE: RES0402_0-5; Chkd/date: VASANTHA/281216; Crtd /date: MAZHAR/120505; Datasheet: Y:\MIS_DATABASE\DATASHEETS\RESISTORS\PAN-ERJSER_NOV17.PDF; Temperature: -55°C+155°C; Weight: 0.8mg; Height: 0.40MM; Library Ref: RESISTOR; Distributor_part_number: P47KJCT-ND; Distributor_name: DIGIKEY; Wattage: 1/10W; Tolerance: 5%; Footprint Ref: RES0402_0-5; Manufacturer: PANASONIC-ECG; PCB Footprint: RES0402_0-5
R84 = RESISTOR_Dup2: RES 6.19K 1/16W 1% 0402; Part Reference: R84; Part_type: RESISTORS\FIXED; Mfr_part_number: RC0402FR-076K19L; Mfr_name: YAGEO AMERICA; Mistral Part No: 110022010013-R; Custom_Duty: 15%; Customs_HS_Code: 85332119; Voltage: NA; Project: J7AHP_PROTO_BRD; Value: 6.19K_1%; Footprint Path: Y:\MIS_DATABASE\Library\ALTIUM_TOOL\PCB_FOOTPRINTS\Altium_Footprint_Lib.PcbLib; Library Path: Y:\MIS_DATABASE\Library\ALTIUM_TOOL\SCHEMATICS_PARTS\MS_DISCRETE_Library.schlib; MECHANICAL 3D STEP FILE: RES0402_0-5; Chkd/date: MANIRAJA/190122; Crtd /date: TAMILARASU/190122; Datasheet: Y:\MIS_DATABASE\DATASHEETS\RESISTORS\RCXXXXL-SER_MAR18.PDF; Temperature: -55°C+155°C; Weight: 0.65mg; Height: 0.40MM; Library Ref: RESISTOR; Distributor_part_number: 311-6.19KLRCT-ND; Distributor_name: DIGIKEY; Wattage: 1/16W; Tolerance: 1%; Footprint Ref: RES0402_0-5; Manufacturer: YAGEO AMERICA; PCB Footprint: RES0402_0-5
R85 = RESISTOR_Dup2: RES 10K 1/16W 1% 0402; Part Reference: R85; Part_type: RESISTORS\FIXED; Mfr_part_number: RC0402FR-0710KL; Mfr_name: YAGEO AMERICA; Mistral Part No: 110015090015-R; Custom_Duty: 15%; Customs_HS_Code: 85332119; Voltage: NA; Project: VOCERA; Value: 10K_1%; Footprint Path: Y:\MIS_DATABASE\Library\ALTIUM_TOOL\PCB_FOOTPRINTS\Altium_Footprint_Lib.PcbLib; Library Path: Y:\MIS_DATABASE\Library\ALTIUM_TOOL\SCHEMATICS_PARTS\MS_DISCRETE_Library.schlib; MECHANICAL 3D STEP FILE: RES0402_0-5; Chkd/date: VASANTHA/201216; Crtd /date: GEETHA/290506; Datasheet: Y:\MIS_DATABASE\DATASHEETS\RESISTORS\RCXXXXL-SER_MAR18.PDF; Temperature: -55°C+155°C; Weight: 0.65mg; Height: 0.40MM; Library Ref: RESISTOR; Distributor_part_number: 311-10.0KLRTR-ND; Distributor_name: DIGIKEY; Wattage: 1/16W; Tolerance: 1%; Footprint Ref: RES0402_0-5; Manufacturer: YAGEO AMERICA; PCB Footprint: RES0402_0-5
R91 = RESISTOR_Dup2: RES 1.8K 1/16W 5% AUTO 0402; Part Reference: R91; Part_type: RESISTORS\FIXED; Mfr_part_number: RC0402JR-071K8L; Mfr_name: YAGEO; Mistral Part No: 110009030147-R; Custom_Duty: 15%; Customs_HS_Code: 85332119; Voltage: NA; Project: MARP; Value: 1.8K; Footprint Path: Y:\MIS_DATABASE\Library\ALTIUM_TOOL\PCB_FOOTPRINTS\Altium_Footprint_Lib.PcbLib; Library Path: Y:\MIS_DATABASE\Library\ALTIUM_TOOL\SCHEMATICS_PARTS\MS_DISCRETE_Library.schlib; MECHANICAL 3D STEP FILE: RES0402_0-5; Chkd/date: MAZHAR/170709; Crtd /date: MAZHAR/200907; Datasheet: Y:\MIS_DATABASE\DATASHEETS\RESISTORS\MCR10.PDF; Temperature: -55°C+155°C; Weight: 0.57mg; Height: 0.40MM; Library Ref: RESISTOR; Distributor_part_number: RHM1.8KJCT-ND; Distributor_name: DIGIKEY; Wattage: 1/16W; Tolerance: 5%; Footprint Ref: RES0402_0-5; Manufacturer: YAGEO; PCB Footprint: RES0402_0-5
R98 = RESISTOR_Dup2: RES 47.5K 1/16W 1% 0402; Part Reference: R98; Part_type: RESISTORS\FIXED; Mfr_part_number: CRCW040247K5FKED; Mfr_name: VISHAY; Mistral Part No: 110017010006-R; Custom_Duty: 15%; Customs_HS_Code: 85332119; Voltage: NA; Project: TPR12_SVB; Value: 47.5K_1%; Footprint Path: Y:\MIS_DATABASE\Library\ALTIUM_TOOL\PCB_FOOTPRINTS\Altium_Footprint_Lib.PcbLib; Library Path: Y:\MIS_DATABASE\Library\ALTIUM_TOOL\SCHEMATICS_PARTS\MS_DISCRETE_Library.schlib; MECHANICAL 3D STEP FILE: RES0402_0-5; Chkd/date: MANIRAJA/170320; Crtd /date: MANIRAJA/170320; Datasheet: Y:\MIS_DATABASE\DATASHEETS\RESISTORS\CRCW0603.PDF; Temperature: -55°C+155°C; Weight: 0.65mg; Height: 0.40MM; Library Ref: RESISTOR; Distributor_part_number: 541-47.5KLCT-ND; Distributor_name: DIGIKEY; Wattage: 1/16W; Tolerance: 1%; Footprint Ref: RES0402_0-5; Manufacturer: VISHAY; PCB Footprint: RES0402_0-5
R99 = RESISTOR_Dup2: RES 6.19K 1/16W 1% 0402; Part Reference: R99; Mistral Part No: 110022010013-R; Mfr_name: YAGEO AMERICA; Mfr_part_number: RC0402FR-076K19L; Part_type: RESISTORS\FIXED; Project: J7AHP_PROTO_BRD; Voltage: NA; Customs_HS_Code: 85332119; Custom_Duty: 15%; Value: 6.19K_1%; Footprint Ref: RES0402_0-5; Tolerance: 1%; Wattage: 1/16W; Distributor_name: DIGIKEY; Distributor_part_number: 311-6.19KLRCT-ND; Library Ref: RESISTOR; Height: 0.40MM; Weight: 0.65mg; Temperature: -55°C+155°C; Datasheet: Y:\MIS_DATABASE\DATASHEETS\RESISTORS\RCXXXXL-SER_MAR18.PDF; Crtd /date: TAMILARASU/190122; Chkd/date: MANIRAJA/190122; MECHANICAL 3D STEP FILE: RES0402_0-5; Library Path: Y:\MIS_DATABASE\Library\ALTIUM_TOOL\SCHEMATICS_PARTS\MS_DISCRETE_Library.schlib; Footprint Path: Y:\MIS_DATABASE\Library\ALTIUM_TOOL\PCB_FOOTPRINTS\Altium_Footprint_Lib.PcbLib; Manufacturer: YAGEO AMERICA; PCB Footprint: RES0402_0-5
R102 = RESISTOR_Dup2: RES 10K 1/16W 1% 0402; Part Reference: R102; Part_type: RESISTORS\FIXED; Mfr_part_number: RC0402FR-0710KL; Mfr_name: YAGEO AMERICA; Mistral Part No: 110015090015-R; Custom_Duty: 15%; Customs_HS_Code: 85332119; Voltage: NA; Project: VOCERA; Value: 10K_1%; Footprint Path: Y:\MIS_DATABASE\Library\ALTIUM_TOOL\PCB_FOOTPRINTS\Altium_Footprint_Lib.PcbLib; Library Path: Y:\MIS_DATABASE\Library\ALTIUM_TOOL\SCHEMATICS_PARTS\MS_DISCRETE_Library.schlib; MECHANICAL 3D STEP FILE: RES0402_0-5; Chkd/date: VASANTHA/201216; Crtd /date: GEETHA/290506; Datasheet: Y:\MIS_DATABASE\DATASHEETS\RESISTORS\RCXXXXL-SER_MAR18.PDF; Temperature: -55°C+155°C; Weight: 0.65mg; Height: 0.40MM; Library Ref: RESISTOR; Distributor_part_number: 311-10.0KLRTR-ND; Distributor_name: DIGIKEY; Wattage: 1/16W; Tolerance: 1%; Footprint Ref: RES0402_0-5; Manufacturer: YAGEO AMERICA; PCB Footprint: RES0402_0-5
TP29 = TESTPOINT_Dup1: TESTPOINT CIR 30 SMD; Part Reference: TP29; Mistral Part No: 130009030930; Mfr_name: LOCAL; Project: BT MODULE_CSRBC04; Tolerance: NA; Value: TP30_SMD; Footprint Ref: TP30_SMD; Mfr_part_number: TP30_SMD; Part_type: TESTPOINT; Voltage: NA; Wattage: NA; Package: SMD; Distributor_name: NA; Distributor_part_number: NA; Library Ref: TESTPOINT; Height: NA; Weight: NA; Temperature: NA; Datasheet: NA; Crtd /date: MAZHAR/171006; Chkd/date: SHREESHAIL/171006; RoHS: NA; Customs_HS_Code: NA; Custom_Duty: NA; MECHANICAL 3D STEP FILE: NA; Library Path: Y:\MIS_DATABASE\Library\ALTIUM_TOOL\SCHEMATICS_PARTS\MS_DISCRETE_Library.schlib; Footprint Path: Y:\MIS_DATABASE\Library\ALTIUM_TOOL\PCB_FOOTPRINTS\Altium_Footprint_Lib.PcbLib; Manufacturer: LOCAL; PCB Footprint: TP30_SMD
U16 = TPS62872-Q1_VQFN16: IC 2.7-6V INPUT 15A STACKABLE FAST TRANSIENT SYNCHRONOUS STEP-DOWN DC-DC CONVERTER VQFN16; Part Reference: U16; Part_type: ICS\POWER\DC-DC CONVERTER; Mfr_name: TEXAS INSTRUMENTS; Mistral Part No: 142022030022; Custom_Duty: 15%; Customs_HS_Code: 85423100; Wattage: NA; Project: TI_J7AHP_EVM_BRD; Remarks: CREATED SAME AS  TPS62873QWRXSR-Q1; Value: TPS62873Y1QWRXSRQ1; Footprint Path: Y:\MIS_DATABASE\Library\ALTIUM_TOOL\PCB_FOOTPRINTS\Altium_Footprint_Lib.PcbLib; Library Path: Y:\MIS_DATABASE\Library\ALTIUM_TOOL\SCHEMATICS_PARTS\MS_MISCPOWER_Library.schlib; MECHANICAL 3D STEP FILE: VQFN16_TPS62872-Q1_100X140_1-1; RoHS: NA; Chkd/date: ALVY/280322; Crtd /date: ALVY/280322; Datasheet: Y:\MIS_DATABASE\DATASHEETS\ICS\POWER\TPS6287X-Q1.PDF; Temperature: -40°C+150°C; Weight: NA; Height: 1.05MM; Library Ref: TPS62872-Q1_VQFN16; Distributor_part_number: NA; Distributor_name: NA; Package: VQFN16; Voltage: NA; Tolerance: NA; Mfr_part_number: TPS62873Y1QWRXSRQ1; Footprint Ref: VQFN16_TPS62872-Q1_100X140_1-1; Manufacturer: TEXAS INSTRUMENTS; PCB Footprint: VQFN16_TPS62872-Q1_100X140_1-1
U19 = TPS62872-Q1_VQFN16: IC 2.7-6V INPUT 15A STACKABLE FAST TRANSIENT SYNCHRONOUS STEP-DOWN DC-DC CONVERTER VQFN16; Part Reference: U19; Part_type: ICS\POWER\DC-DC CONVERTER; Mfr_name: TEXAS INSTRUMENTS; Mistral Part No: 142022030022; Custom_Duty: 15%; Customs_HS_Code: 85423100; Wattage: NA; Project: TI_J7AHP_EVM_BRD; Remarks: CREATED SAME AS  TPS62873QWRXSR-Q1; Value: TPS62873Y1QWRXSRQ1; Footprint Path: Y:\MIS_DATABASE\Library\ALTIUM_TOOL\PCB_FOOTPRINTS\Altium_Footprint_Lib.PcbLib; Library Path: Y:\MIS_DATABASE\Library\ALTIUM_TOOL\SCHEMATICS_PARTS\MS_MISCPOWER_Library.schlib; MECHANICAL 3D STEP FILE: VQFN16_TPS62872-Q1_100X140_1-1; RoHS: NA; Chkd/date: ALVY/280322; Crtd /date: ALVY/280322; Datasheet: Y:\MIS_DATABASE\DATASHEETS\ICS\POWER\TPS6287X-Q1.PDF; Temperature: -40°C+150°C; Weight: NA; Height: 1.05MM; Library Ref: TPS62872-Q1_VQFN16; Distributor_part_number: NA; Distributor_name: NA; Package: VQFN16; Voltage: NA; Tolerance: NA; Mfr_part_number: TPS62873Y1QWRXSRQ1; Footprint Ref: VQFN16_TPS62872-Q1_100X140_1-1; Manufacturer: TEXAS INSTRUMENTS; PCB Footprint: VQFN16_TPS62872-Q1_100X140_1-1